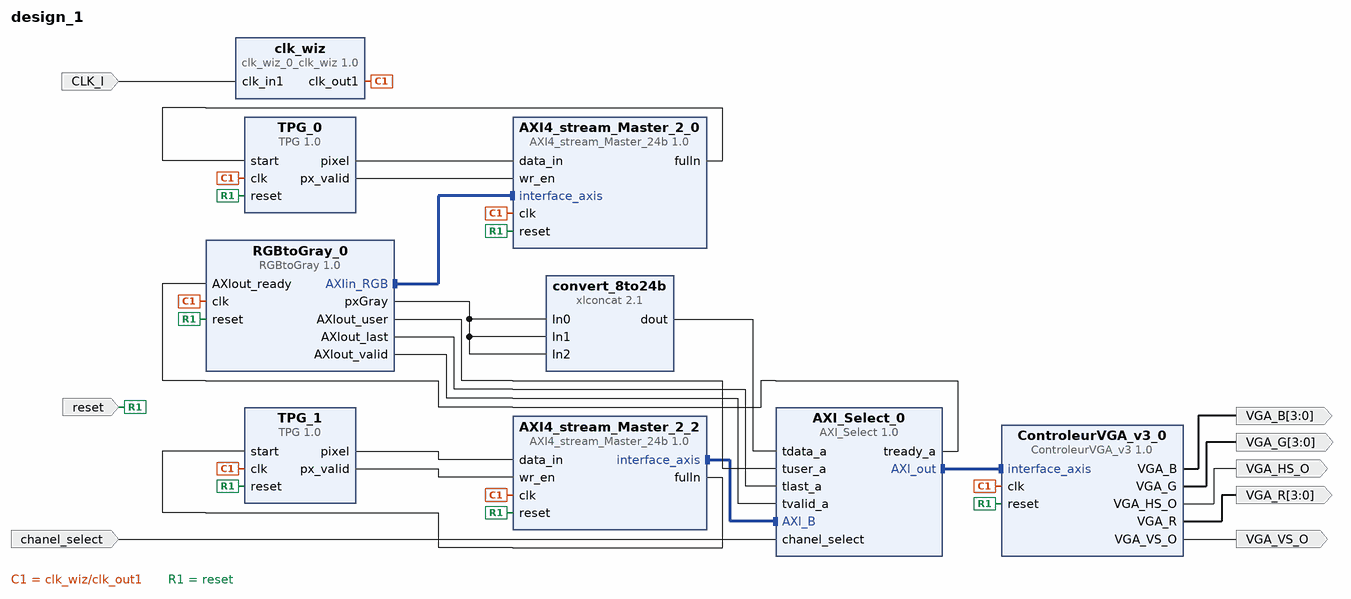
[diagram p0: block diagram of the top level]
# Vivado block design design_1, xc7z007sclg400-1, Vivado 2020.2
create_bd_design design_1

create_bd_port -dir I -type rst reset
set_property -dict {CONFIG.POLARITY ACTIVE_HIGH} [get_bd_ports reset]
create_bd_port -dir I CLK_I
create_bd_port -dir I chanel_select
create_bd_port -dir O -from 3 -to 0 VGA_B
create_bd_port -dir O -from 3 -to 0 VGA_R
create_bd_port -dir O VGA_VS_O
create_bd_port -dir O VGA_HS_O
create_bd_port -dir O -from 3 -to 0 VGA_G

create_bd_cell -type ip -vlnv user.org:user:AXI4_stream_Master_24b:1.0 AXI4_stream_Master_2_0
create_bd_cell -type ip -vlnv xilinx.com:ip:xlconcat:2.1 convert_8to24b
set_property -dict {CONFIG.IN0_WIDTH 8 CONFIG.IN1_WIDTH 8 CONFIG.IN2_WIDTH 8 CONFIG.NUM_PORTS 3} [get_bd_cells convert_8to24b]
create_bd_cell -type ip -vlnv user.org:user:clk_wiz_0_clk_wiz:1.0 clk_wiz
create_bd_cell -type ip -vlnv user.org:user:AXI4_stream_Master_24b:1.0 AXI4_stream_Master_2_2
set_property -dict {CONFIG.nb_ligne 480} [get_bd_cells AXI4_stream_Master_2_2]
create_bd_cell -type ip -vlnv user.org:user:RGBtoGray:1.0 RGBtoGray_0
create_bd_cell -type ip -vlnv user.org:user:TPG:1.0 TPG_0
create_bd_cell -type ip -vlnv user.org:user:TPG:1.0 TPG_1
create_bd_cell -type ip -vlnv user.org:user:AXI_Select:1.0 AXI_Select_0
create_bd_cell -type ip -vlnv user.org:user:ControleurVGA_v3:1.0 ControleurVGA_v3_0

# ---- connections ----

connect_bd_intf_net [get_bd_intf_pins RGBtoGray_0/AXIin_RGB] [get_bd_intf_pins AXI4_stream_Master_2_0/interface_axis]
connect_bd_intf_net [get_bd_intf_pins ControleurVGA_v3_0/interface_axis] [get_bd_intf_pins AXI_Select_0/AXI_out]
connect_bd_intf_net [get_bd_intf_pins AXI4_stream_Master_2_2/interface_axis] [get_bd_intf_pins AXI_Select_0/AXI_B]
connect_bd_net [get_bd_pins TPG_0/pixel] [get_bd_pins AXI4_stream_Master_2_0/data_in]
connect_bd_net [get_bd_pins TPG_0/px_valid] [get_bd_pins AXI4_stream_Master_2_0/wr_en]
connect_bd_net [get_bd_pins AXI4_stream_Master_2_0/fulln] [get_bd_pins TPG_0/start]
connect_bd_net -net clk_0_1 [get_bd_pins clk_wiz/clk_out1] \
  [get_bd_pins AXI4_stream_Master_2_0/clk] [get_bd_pins AXI4_stream_Master_2_2/clk] [get_bd_pins RGBtoGray_0/clk] \
  [get_bd_pins TPG_0/clk] [get_bd_pins TPG_1/clk] [get_bd_pins ControleurVGA_v3_0/clk]
connect_bd_net -net reset_0_1 [get_bd_ports reset] \
  [get_bd_pins AXI4_stream_Master_2_0/reset] [get_bd_pins AXI4_stream_Master_2_2/reset] [get_bd_pins RGBtoGray_0/reset] \
  [get_bd_pins TPG_0/reset] [get_bd_pins TPG_1/reset] [get_bd_pins ControleurVGA_v3_0/reset]
connect_bd_net [get_bd_pins RGBtoGray_0/pxGray] [get_bd_pins convert_8to24b/In0] [get_bd_pins convert_8to24b/In1] [get_bd_pins convert_8to24b/In2]
connect_bd_net -net clk_in1_0_1 [get_bd_ports CLK_I] [get_bd_pins clk_wiz/clk_in1]
connect_bd_net [get_bd_pins TPG_1/pixel] [get_bd_pins AXI4_stream_Master_2_2/data_in]
connect_bd_net [get_bd_pins TPG_1/px_valid] [get_bd_pins AXI4_stream_Master_2_2/wr_en]
connect_bd_net [get_bd_pins AXI4_stream_Master_2_2/fulln] [get_bd_pins TPG_1/start]
connect_bd_net -net chanel_select_0_1 [get_bd_ports chanel_select] [get_bd_pins AXI_Select_0/chanel_select]
connect_bd_net [get_bd_pins convert_8to24b/dout] [get_bd_pins AXI_Select_0/tdata_a]
connect_bd_net [get_bd_pins RGBtoGray_0/AXIout_user] [get_bd_pins AXI_Select_0/tuser_a]
connect_bd_net [get_bd_pins RGBtoGray_0/AXIout_last] [get_bd_pins AXI_Select_0/tlast_a]
connect_bd_net [get_bd_pins RGBtoGray_0/AXIout_valid] [get_bd_pins AXI_Select_0/tvalid_a]
connect_bd_net [get_bd_pins AXI_Select_0/tready_a] [get_bd_pins RGBtoGray_0/AXIout_ready]
connect_bd_net [get_bd_pins ControleurVGA_v3_0/VGA_B] [get_bd_ports VGA_B]
connect_bd_net [get_bd_pins ControleurVGA_v3_0/VGA_R] [get_bd_ports VGA_R]
connect_bd_net [get_bd_pins ControleurVGA_v3_0/VGA_VS_O] [get_bd_ports VGA_VS_O]
connect_bd_net [get_bd_pins ControleurVGA_v3_0/VGA_HS_O] [get_bd_ports VGA_HS_O]
connect_bd_net [get_bd_pins ControleurVGA_v3_0/VGA_G] [get_bd_ports VGA_G]

validate_bd_design
save_bd_design
